# EAGLE schematic HandCream2040 (EAGLE 9.6.2)
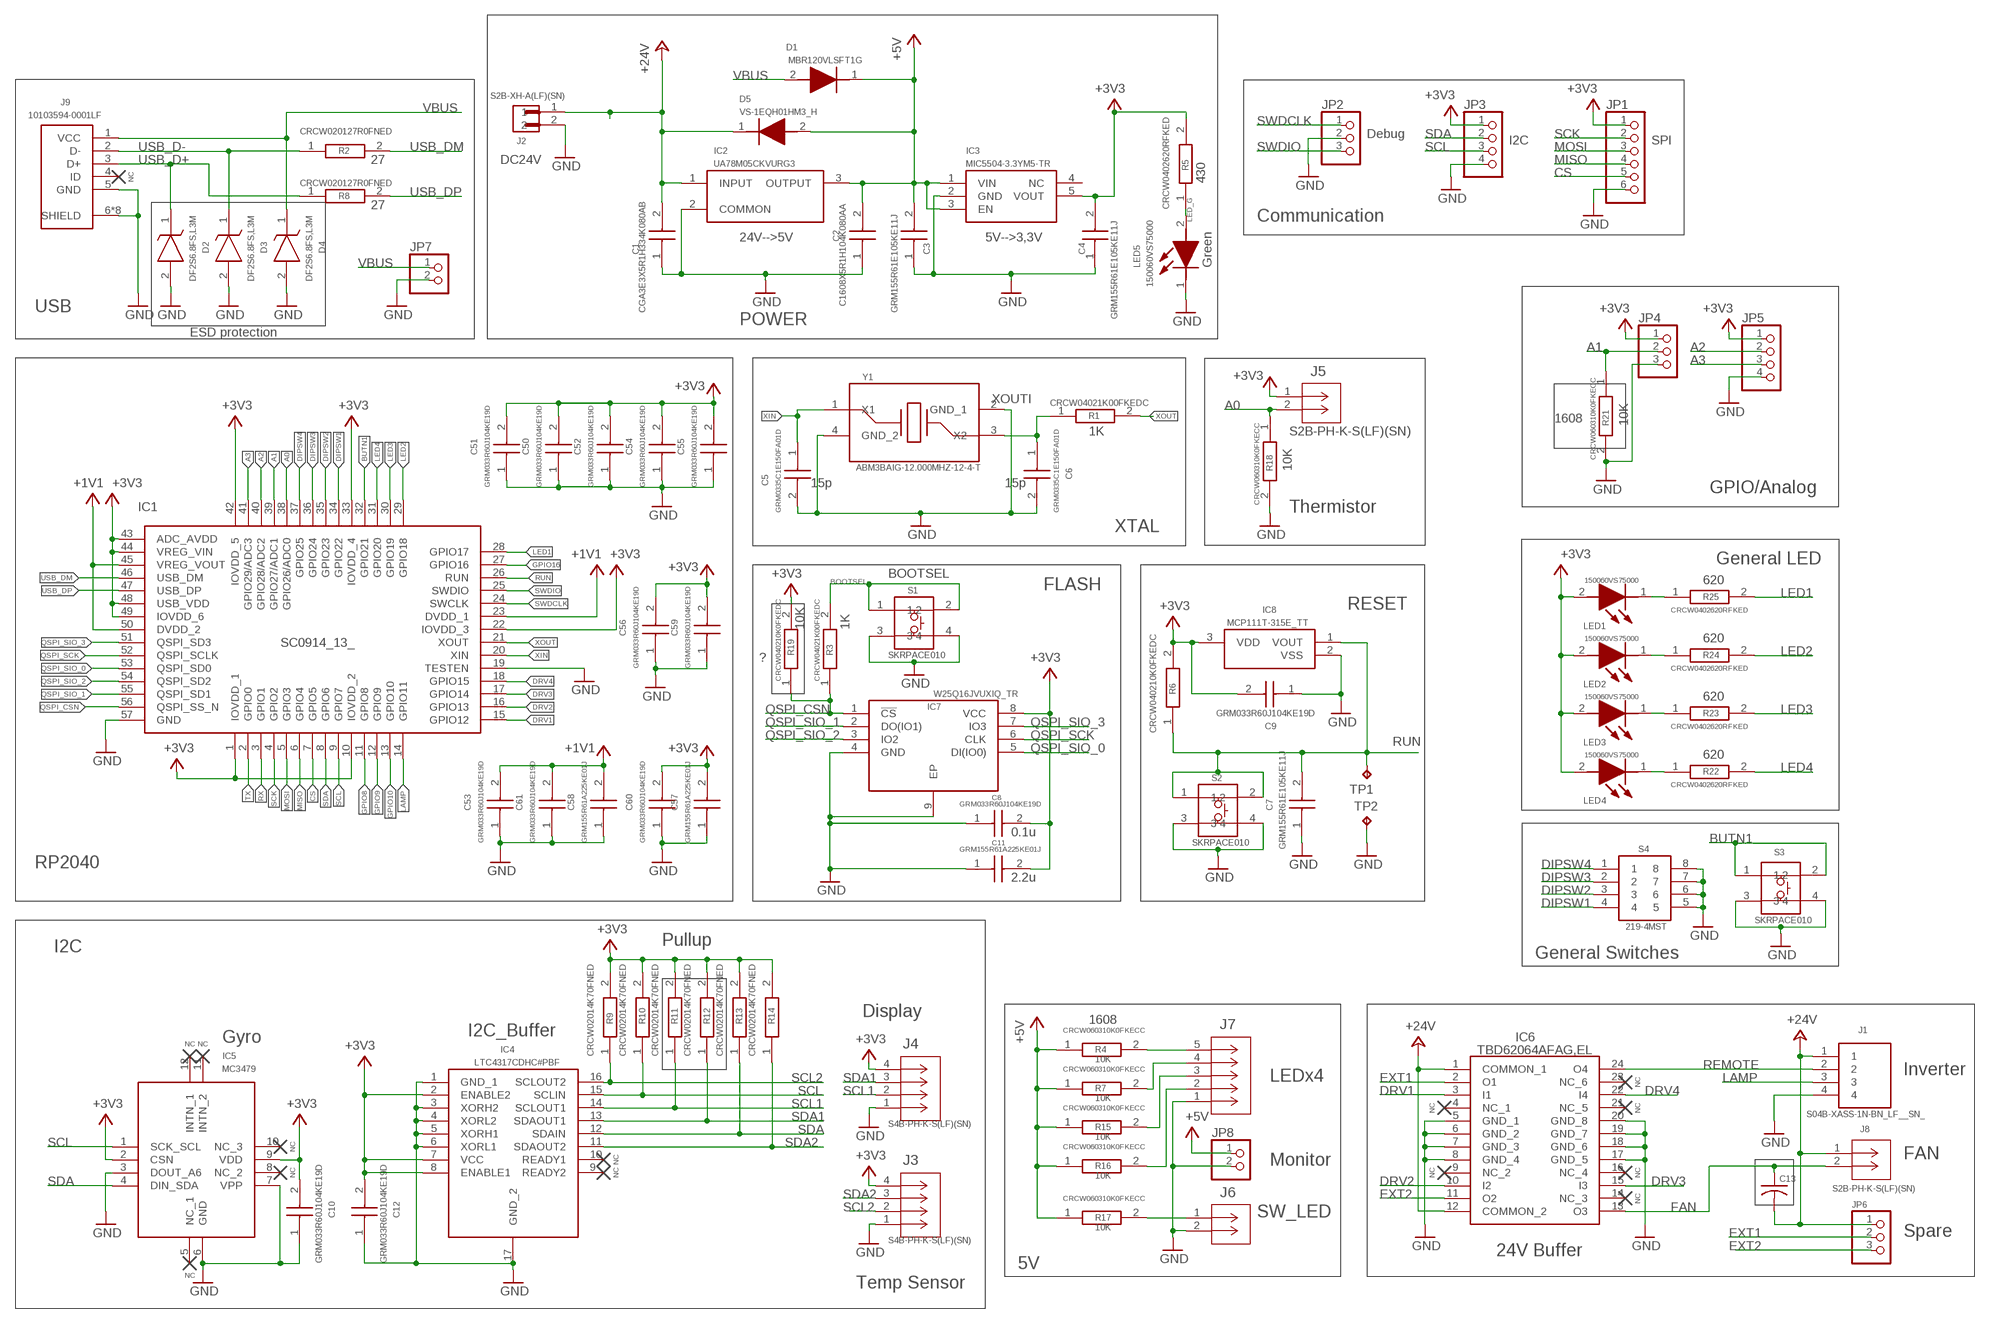
[diagram p0: schematic, sheet 1]

## Parts
C1  CGA3E3X5R1H334K080AB  [CAPC1608X90N]
C2  C1608X5R1H104K080AA  [CAPC1608X80N]
C3  GRM155R61E105KE11J  [CAPC1005X55N]
C4  GRM155R61E105KE11J  [CAPC1005X55N]
C5  GRM0335C1E150FA01D  [CAPC0603X33N]
C6  GRM0335C1E150FA01D  [CAPC0603X33N]
C7  GRM155R61E105KE11J  [CAPC1005X55N]
C8  GRM033R60J104KE19D  [CAPC0603X33N]
C9  GRM033R60J104KE19D  [CAPC0603X33N]
C10  GRM033R60J104KE19D  [CAPC0603X33N]
C11  GRM155R61A225KE01J  [CAPC1005X55N]
C12  GRM033R60J104KE19D  [CAPC0603X33N]
C13  C-US025-024X044  [C025-024X044]
C50  GRM033R60J104KE19D  [CAPC0603X33N]
C51  GRM033R60J104KE19D  [CAPC0603X33N]
C52  GRM033R60J104KE19D  [CAPC0603X33N]
C53  GRM033R60J104KE19D  [CAPC0603X33N]
C54  GRM033R60J104KE19D  [CAPC0603X33N]
C55  GRM033R60J104KE19D  [CAPC0603X33N]
C56  GRM033R60J104KE19D  [CAPC0603X33N]
C57  GRM155R61A225KE01J  [CAPC1005X55N]
C58  GRM155R61A225KE01J  [CAPC1005X55N]
C59  GRM033R60J104KE19D  [CAPC0603X33N]
C60  GRM033R60J104KE19D  [CAPC0603X33N]
C61  GRM033R60J104KE19D  [CAPC0603X33N]
D1  MBR120VLSFT1G  [SODFL3616X98N]
D2  DF2S6.8FS,L3M  [SODFL1006X45N]
D3  DF2S6.8FS,L3M  [SODFL1006X45N]
D4  DF2S6.8FS,L3M  [SODFL1006X45N]
D5  VS-1EQH01HM3_H  [VS1EQH01HM3H]
IC1  SC0914_13_  [SC091413]
IC2  UA78M05CKVURG3  [TPS7A6533QKVURQ1]
IC3  MIC5504-3.3YM5-TR  [SOT95P280X145-5N]
IC4  LTC4317CDHC#PBF  [SON50P300X500X80-17N]
IC5  MC3479  [MC3479]
IC6  TBD62064AFAG,EL  [SOP100P800X190-24N]
IC7  W25Q16JVUXIQ_TR  [SON50P300X200X60-9N]
IC8  MCP111T-315E_TT  [SOT96P237X112-3N]
J1  S04B-XASS-1N-BN_LF__SN_  [S04BXASS1NBNLFSN]
J2  S2B-XH-A(LF)(SN)  [JST_S2B-XH-A(LF)(SN)]
J3  S4B-PH-K-S(LF)(SN)  [CONN_S4B-PH-K-S_JST]
J4  S4B-PH-K-S(LF)(SN)  [CONN_S4B-PH-K-S_JST]
J5  S2B-PH-K-S(LF)(SN)  [CONN_S2B-PH-K-S_JST]
J6  S2B-PH-K-S(LF)(SN)  [CONN_S2B-PH-K-S_JST]
J7  S5B-PH-K-S_(LF)(SN)  [CONN_S5B-PH-K-S_JST]
J8  S2B-PH-K-S(LF)(SN)  [CONN_S2B-PH-K-S_JST]
J9  10103594-0001LF  [AMPHENOL_10103594-0001LF]
JP1  PINHD-1X6  [1X06]
JP2  PINHD-1X3  [1X03]
JP3  PINHD-1X4  [1X04]
JP4  PINHD-1X3  [1X03]
JP5  PINHD-1X4  [1X04]
JP6  PINHD-1X3  [1X03]
JP7  PINHD-1X2  [1X02]
JP8  PINHD-1X2  [1X02]
LED1  150060VS75000  [LEDC1608X80N]
LED2  150060VS75000  [LEDC1608X80N]
LED3  150060VS75000  [LEDC1608X80N]
LED4  150060VS75000  [LEDC1608X80N]
LED5  150060VS75000  [LEDC1608X80N]
R1  CRCW04021K00FKEDC  [RESC1005X35N]
R2  CRCW020127R0FNED  [RESC0603X28N]
R3  CRCW04021K00FKEDC  [RESC1005X35N]
R4  CRCW060310K0FKECC  [RESC1608X55N]
R5  CRCW0402620RFKED  [RESC1005X40N]
R6  CRCW040210K0FKEDC  [RESC1005X35N]
R7  CRCW060310K0FKECC  [RESC1608X55N]
R8  CRCW020127R0FNED  [RESC0603X28N]
R9  CRCW02014K70FNED  [RESC0603X28N]
R10  CRCW02014K70FNED  [RESC0603X28N]
R11  CRCW02014K70FNED  [RESC0603X28N]
R12  CRCW02014K70FNED  [RESC0603X28N]
R13  CRCW02014K70FNED  [RESC0603X28N]
R14  CRCW02014K70FNED  [RESC0603X28N]
R15  CRCW060310K0FKECC  [RESC1608X55N]
R16  CRCW060310K0FKECC  [RESC1608X55N]
R17  CRCW060310K0FKECC  [RESC1608X55N]
R18  CRCW060310K0FKECC  [RESC1608X55N]
R19  CRCW040210K0FKEDC  [RESC1005X35N]
R21  CRCW060310K0FKECC  [RESC1608X55N]
R22  CRCW0402620RFKED  [RESC1005X40N]
R23  CRCW0402620RFKED  [RESC1005X40N]
R24  CRCW0402620RFKED  [RESC1005X40N]
R25  CRCW0402620RFKED  [RESC1005X40N]
S1  SKRPACE010  [SMT(4.2X3.2)]
S2  SKRPACE010  [SMT(4.2X3.2)]
S3  SKRPACE010  [SMT(4.2X3.2)]
S4  219-4MST  [2194MST]
TP1  TPB1,27  [B1,27]
TP2  TPB1,27  [B1,27]
Y1  ABM3BAIG-12.000MHZ-12-4-T  [ABM3BAIG]

## Nets
+1V1: C53.2 C58.2 C61.2 IC1.23(DVDD_1) IC1.45(VREG_VOUT) IC1.50(DVDD_2)
+3V3: C4.2 C8.2 C9.2 C10.2 C11.2 C12.2 C50.2 C51.2 C52.2 C54.2 C55.2 C56.2 C57.2 C59.2 C60.2 IC1.1(IOVDD_1) IC1.10(IOVDD_2) IC1.22(IOVDD_3) IC1.33(IOVDD_4) IC1.42(IOVDD_5) IC1.43(ADC_AVDD) IC1.44(VREG_VIN) IC1.48(USB_VDD) IC1.49(IOVDD_6) IC3.5(VOUT) IC4.2(ENABLE2) IC4.7(VCC) IC4.8(ENABLE1) IC5.2(CSN) IC5.9(VDD) IC7.8(VCC) IC8.3(VDD) J3.4 J4.4 J5.1 JP1.1 JP3.1 JP4.1 JP5.1 LED1.2(A) LED2.2(A) LED3.2(A) LED4.2(A) R5.2 R6.2 R9.2 R10.2 R11.2 R12.2 R13.2 R14.2 R19.2
+5V: C2.2 C3.2 D1.1(K) D5.2(A) IC2.3(OUTPUT) IC3.1(VIN) IC3.3(EN) JP8.1 R4.1 R7.1 R15.1 R16.1 R17.1
+24V: C1.2 C13.2 D5.1(K) IC2.1(INPUT) IC6.1(COMMON_1) IC6.12(COMMON_2) J1.1 J2.1 J8.1 JP6.1
A0: IC1.38(GPIO26/ADC0) J5.2 R18.1
A1: IC1.39(GPIO27/ADC1) JP4.2 R21.1
A2: IC1.40(GPIO28/ADC2) JP5.2
A3: IC1.41(GPIO29/ADC3) JP5.3
BOOTSEL: R3.2 S1.1 S1.2
BUTN1: IC1.32(GPIO21) S3.1 S3.2
CS: IC1.7(GPIO5) JP1.5
DIPSW1: IC1.34(GPIO22) S4.4
DIPSW2: IC1.35(GPIO23) S4.3
DIPSW3: IC1.36(GPIO24) S4.2
DIPSW4: IC1.37(GPIO25) S4.1
DRV1: IC1.15(GPIO12) IC6.3(I1)
DRV2: IC1.16(GPIO13) IC6.10(I2)
DRV3: IC1.17(GPIO14) IC6.15(I3)
DRV4: IC1.18(GPIO15) IC6.22(I4)
EXT1: IC6.2(O1) JP6.2
EXT2: IC6.11(O2) JP6.3
FAN: C13.1 IC6.13(O3) J8.2
GND: C1.1 C2.1 C3.1 C4.1 C5.2 C6.2 C7.1 C8.1 C9.1 C10.1 C11.1 C12.1 C50.1 C51.1 C52.1 C53.1 C54.1 C55.1 C56.1 C57.1 C58.1 C59.1 C60.1 C61.1 D2.2(A) D3.2(A) D4.2(A) IC1.19(TESTEN) IC1.57(GND) IC2.2(COMMON) IC3.2(GND) IC4.1(GND_1) IC4.3(XORH2) IC4.4(XORL2) IC4.5(XORH1) IC4.6(XORL1) IC4.17(GND_2) IC5.3(DOUT_A6) IC5.6(GND) IC5.7(VPP) IC6.5(GND_1) IC6.6(GND_2) IC6.7(GND_3) IC6.8(GND_4) IC6.17(GND_5) IC6.18(GND_6) IC6.19(GND_7) IC6.20(GND_8) IC7.4(GND) IC7.9(EP) IC8.2(VSS) J1.4 J2.2 J3.1 J4.1 J6.2 J7.1 J9.5(GND) J9.6(SHIELD) J9.7(SHIELD) J9.8(SHIELD) J9.9(SHIELD) J9.10(SHIELD) J9.11(SHIELD) J9.S1(SHIELD) J9.S2(SHIELD) JP1.6 JP2.2 JP3.4 JP4.3 JP5.4 JP7.2 JP8.2 LED5.1(K) R18.2 R21.2 S1.3 S1.4 S2.3 S2.4 S3.3 S3.4 S4.5 S4.6 S4.7 S4.8 TP2.TP Y1.2(GND_1) Y1.4(GND_2)
GPIO8: IC1.11(GPIO8)
GPIO9: IC1.12(GPIO9)
GPIO10: IC1.13(GPIO10)
GPIO16: IC1.27(GPIO16)
LAMP: IC1.14(GPIO11) J1.3
LED1: IC1.28(GPIO17) R25.2
LED2: IC1.29(GPIO18) R24.2
LED3: IC1.30(GPIO19) R23.2
LED4: IC1.31(GPIO20) R22.2
LED_G: LED5.2(A) R5.1
MISO: IC1.6(GPIO4) JP1.4
MOSI: IC1.5(GPIO3) JP1.3
N$3: J7.5 R4.2
N$5: J7.4 R7.2
N$6: J7.3 R15.2
N$7: J7.2 R16.2
N$8: J6.1 R17.2
N$9: LED1.1(K) R25.1
N$11: LED2.1(K) R24.1
N$12: LED3.1(K) R23.1
N$13: LED4.1(K) R22.1
QSPI_CSN: IC1.56(QSPI_SS_N) IC7.1(!CS) R3.1 R19.1
QSPI_SCK: IC1.52(QSPI_SCLK) IC7.6(CLK)
QSPI_SIO_0: IC1.53(QSPI_SD0) IC7.5(DI(IO0))
QSPI_SIO_1: IC1.55(QSPI_SD1) IC7.2(DO(IO1))
QSPI_SIO_2: IC1.54(QSPI_SD2) IC7.3(IO2)
QSPI_SIO_3: IC1.51(QSPI_SD3) IC7.7(IO3)
REMOTE: IC6.24(O4) J1.2
RUN: C7.2 IC1.26(RUN) IC8.1(VOUT) R6.1 S2.1 S2.2 TP1.TP
RX: IC1.3(GPIO1)
SCK: IC1.4(GPIO2) JP1.2
SCL: IC1.9(GPIO7) IC4.15(SCLIN) IC5.1(SCK_SCL) JP3.3 R10.1
SCL1: IC4.14(SCLOUT1) J4.2 R11.1
SCL2: IC4.16(SCLOUT2) J3.2 R9.1
SDA: IC1.8(GPIO6) IC4.12(SDAIN) IC5.4(DIN_SDA) JP3.2 R13.1
SDA1: IC4.13(SDAOUT1) J4.3 R12.1
SDA2: IC4.11(SDAOUT2) J3.3 R14.1
SWDCLK: IC1.24(SWCLK) JP2.1
SWDIO: IC1.25(SWDIO) JP2.3
TX: IC1.2(GPIO0)
USB_D+: D2.1(K) J9.3(D+) R8.1
USB_D-: D3.1(K) J9.2(D-) R2.1
USB_DM: IC1.46(USB_DM) R2.2
USB_DP: IC1.47(USB_DP) R8.2
VBUS: D1.2(A) D4.1(K) J9.1(VCC) JP7.1
XIN: C5.1 IC1.20(XIN) Y1.1(X1)
XOUT: IC1.21(XOUT) R1.2
XOUTI: C6.1 R1.1 Y1.3(X2)
Unconnected: IC3.4(NC) IC4.9(READY2) IC4.10(READY1) IC5.5(NC_1) IC5.8(NC_2) IC5.10(NC_3) IC5.11(INTN_2) IC5.12(INTN_1) IC6.4(NC_1) IC6.9(NC_2) IC6.14(NC_3) IC6.16(NC_4) IC6.21(NC_5) IC6.23(NC_6) J9.4(ID)

## Notes on the sheet
- Debug
- I2C | SPI
- DC24V
- Communication
- 24V-->5V | 5V-->3,3V
- Green
- USB
- POWER
- ESD protection
- 1608
- GPIO/Analog
- Thermistor
- XTAL
- General LED
- BOOTSEL
- FLASH
- RESET
- ?
- RP2040
- Pullup
- I2C
- General Switches
- Display
- 1608
- I2C_Buffer
- Gyro
- Inverter
- LEDx4
- FAN
- Monitor
- SW_LED
- Spare
- 24V Buffer
- 5V
- Temp Sensor

## Library data of the parts
C1 = HandCream2040:CGA3E3X5R1H334K080AB: TDK 330nF Multilayer Ceramic Capacitor MLCC 50 V dc +/-10% X5R Dielectric 1608 Solder Max. Op. Temp. +85C Source: Datasheet; DESCRIPTION: TDK 330nF Multilayer Ceramic Capacitor MLCC 50 V dc +/-10% X5R Dielectric 1608 Solder Max. Op. Temp. +85C; HEIGHT: 0.9mm; MANUFACTURER_NAME: TDK; MANUFACTURER_PART_NUMBER: CGA3E3X5R1H334K080AB; MOUSER_PART_NUMBER: 810-CGA3E3X5R1H334KB; MOUSER_PRICE-STOCK: https://www.mouser.co.uk/ProductDetail/TDK/CGA3E3X5R1H334K080AB?qs=xLDY6iXSiQYI%252BjKItkDhww%3D%3D
C2 = HandCream2040:C1608X5R1H104K080AA: MULTILAYER CERAMIC CHIP CAPACITORS, 1608, Commercial grade, general (Up to 75V) Source: Datasheet <https://product.tdk.com/info/en/catalog/datasheets/mlcc_commercial_midvoltage_en.pdf>; DESCRIPTION: MULTILAYER CERAMIC CHIP CAPACITORS, 1608, Commercial grade, general (Up to 75V); HEIGHT: 0.8mm; MANUFACTURER_NAME: TDK; MANUFACTURER_PART_NUMBER: C1608X5R1H104K080AA; MOUSER_PART_NUMBER: 810-C1608X5R1H104K; MOUSER_PRICE-STOCK: https://www.mouser.co.uk/ProductDetail/TDK/C1608X5R1H104K080AA?qs=NRhsANhppD%2Fot2mSfg3j9A%3D%3D
C3 C4 C7 = HandCream2040:GRM155R61E105KE11J: Multilayer Ceramic Capacitors MLCC - SMD/SMT Source: Datasheet <http://www.murata.com/~/media/webrenewal/support/library/catalog/products/capacitor/mlcc/c02e.pdf>; DESCRIPTION: Multilayer Ceramic Capacitors MLCC - SMD/SMT; HEIGHT: 0.55mm; MANUFACTURER_NAME: Murata Electronics; MANUFACTURER_PART_NUMBER: GRM155R61E105KE11J; MOUSER_PART_NUMBER: 81-GRM155R61E105KE1J; MOUSER_PRICE-STOCK: https://www.mouser.co.uk/ProductDetail/Murata-Electronics/GRM155R61E105KE11J?qs=QzBtWTOodeVRe4OtPvgZ4A%3D%3D
C5 C6 = HandCream2040:GRM0335C1E150FA01D: Chip Capacitor value 150 Source: Datasheet <http://www.murata.com/~/media/webrenewal/support/library/catalog/products/capacitor/mlcc/c02e.pdf>; C: 15p; DESCRIPTION: Chip Capacitor value 150; HEIGHT: 0.33mm; MANUFACTURER_NAME: Murata Electronics; MANUFACTURER_PART_NUMBER: GRM0335C1E150FA01D; MOUSER_PART_NUMBER: 81-GRM0335C1E150FA1D; MOUSER_PRICE-STOCK: https://www.mouser.co.uk/ProductDetail/Murata-Electronics/GRM0335C1E150FA01D?qs=3ZwS9AhGA%2F5D6R%252BFa%2Fosaw%3D%3D
C8 = HandCream2040:GRM033R60J104KE19D: Ceramic SMT capacitor 100nF 6.3Vdc Murata 0201 GRM 100nF Ceramic Multilayer Capacitor, 6.3 V dc, +85C, X5R Dielectric, +/-10% Source: Datasheet <http://www.murata.com/~/media/webrenewal/support/library/catalog/products/capacitor/mlcc/c02e.pdf>; C: 0.1u; DESCRIPTION: Ceramic SMT capacitor 100nF 6.3Vdc Murata 0201 GRM 100nF Ceramic Multilayer Capacitor, 6.3 V dc, +85C, X5R Dielectric, +/-10%; HEIGHT: 0.33mm; MANUFACTURER_NAME: Murata Electronics; MANUFACTURER_PART_NUMBER: GRM033R60J104KE19D; MOUSER_PART_NUMBER: 81-GRM033R60J104KE19; MOUSER_PRICE-STOCK: https://www.mouser.co.uk/ProductDetail/Murata-Electronics/GRM033R60J104KE19D?qs=GaSm9ipITa4x559m0GMeJg%3D%3D
C9 C10 C12 C50-C56 C59-C61 = HandCream2040:GRM033R60J104KE19D: Ceramic SMT capacitor 100nF 6.3Vdc Murata 0201 GRM 100nF Ceramic Multilayer Capacitor, 6.3 V dc, +85C, X5R Dielectric, +/-10% Source: Datasheet <http://www.murata.com/~/media/webrenewal/support/library/catalog/products/capacitor/mlcc/c02e.pdf>; DESCRIPTION: Ceramic SMT capacitor 100nF 6.3Vdc Murata 0201 GRM 100nF Ceramic Multilayer Capacitor, 6.3 V dc, +85C, X5R Dielectric, +/-10%; HEIGHT: 0.33mm; MANUFACTURER_NAME: Murata Electronics; MANUFACTURER_PART_NUMBER: GRM033R60J104KE19D; MOUSER_PART_NUMBER: 81-GRM033R60J104KE19; MOUSER_PRICE-STOCK: https://www.mouser.co.uk/ProductDetail/Murata-Electronics/GRM033R60J104KE19D?qs=GaSm9ipITa4x559m0GMeJg%3D%3D
C11 = HandCream2040:GRM155R61A225KE01J: Multilayer Ceramic Capacitors MLCC - SMD/SMT Source: Datasheet <http://www.murata.com/~/media/webrenewal/support/library/catalog/products/capacitor/mlcc/c02e.pdf>; C: 2.2u; DESCRIPTION: Multilayer Ceramic Capacitors MLCC - SMD/SMT; HEIGHT: 0.55mm; MANUFACTURER_NAME: Murata Electronics; MANUFACTURER_PART_NUMBER: GRM155R61A225KE01J; MOUSER_PART_NUMBER: 81-GRM155R61A225K01J; MOUSER_PRICE-STOCK: https://www.mouser.co.uk/ProductDetail/Murata-Electronics/GRM155R61A225KE01J?qs=T3oQrply3y82IrfvEpRQug%3D%3D
C13 = HandCream2040:C-US: CAPACITOR, American symbol; SPICEPREFIX: C
C57 C58 = HandCream2040:GRM155R61A225KE01J: Multilayer Ceramic Capacitors MLCC - SMD/SMT Source: Datasheet <http://www.murata.com/~/media/webrenewal/support/library/catalog/products/capacitor/mlcc/c02e.pdf>; DESCRIPTION: Multilayer Ceramic Capacitors MLCC - SMD/SMT; HEIGHT: 0.55mm; MANUFACTURER_NAME: Murata Electronics; MANUFACTURER_PART_NUMBER: GRM155R61A225KE01J; MOUSER_PART_NUMBER: 81-GRM155R61A225K01J; MOUSER_PRICE-STOCK: https://www.mouser.co.uk/ProductDetail/Murata-Electronics/GRM155R61A225KE01J?qs=T3oQrply3y82IrfvEpRQug%3D%3D
D1 = HandCream2040:MBR120VLSFT1G: Diode Schottky 20V 1A SOD123FL ON Semi MBR120VLSFT1G, SMT Schottky Diode, 20V 1A, 2-Pin SOD-123FL Source: Datasheet <http://www.onsemi.com/pub/Collateral/MBR120VLSFT1-D.PDF>; DESCRIPTION: Diode Schottky 20V 1A SOD123FL ON Semi MBR120VLSFT1G, SMT Schottky Diode, 20V 1A, 2-Pin SOD-123FL; HEIGHT: 0.98mm; MANUFACTURER_NAME: onsemi; MANUFACTURER_PART_NUMBER: MBR120VLSFT1G; MOUSER_PART_NUMBER: 863-MBR120VLSFT1G; MOUSER_PRICE-STOCK: https://www.mouser.co.uk/ProductDetail/onsemi/MBR120VLSFT1G?qs=3JMERSakebpX%252BkItPpFCkg%3D%3D
D2-D4 = HandCream2040:DF2S6.8FS,L3M: ESD Suppressors / TVS Diodes ESD Protection Diode Source: Datasheet <http://toshiba.semicon-storage.com/info/docget.jsp?did=22219&prodName=DF2S6.8FS>; DESCRIPTION: ESD Suppressors / TVS Diodes ESD Protection Diode; HEIGHT: 0.45mm; MANUFACTURER_NAME: Toshiba; MANUFACTURER_PART_NUMBER: DF2S6.8FS,L3M; MOUSER_PART_NUMBER: 757-DF2S68FSL3M; MOUSER_PRICE-STOCK: https://www.mouser.co.uk/ProductDetail/Toshiba/DF2S6.8FSL3M?qs=eRmS5dli9yOjw7NUk6y8KQ%3D%3D
D5 = HandCream2040:VS-1EQH01HM3_H: Rectifiers 100V 1A Fred Pt MicroSMP (DO-219AD) Source: Datasheet <https://www.vishay.com/docs/96563/vs-1eqh02hm3.pdf>; DESCRIPTION: Rectifiers 100V 1A Fred Pt MicroSMP (DO-219AD); HEIGHT: 0.73mm; MANUFACTURER_NAME: Vishay; MANUFACTURER_PART_NUMBER: VS-1EQH01HM3/H; MOUSER_PART_NUMBER: 78-VS-1EQH01HM3/H; MOUSER_PRICE-STOCK: https://www.mouser.co.uk/ProductDetail/Vishay-Semiconductors/VS-1EQH01HM3-H?qs=BJlw7L4Cy78xxlCx4HTbcA%3D%3D
IC1 = HandCream2040:SC0914_13_: ARM Cortex-M0+ - Microcontroller IC 32-Bit Dual-Core 133MHz External Program Memory 56-QFN (7x7) Source: Datasheet <https://datasheets.raspberrypi.com/rp2040/rp2040-datasheet.pdf>; DESCRIPTION: ARM Cortex-M0+ - Microcontroller IC 32-Bit Dual-Core 133MHz External Program Memory 56-QFN (7x7); HEIGHT: 0.9mm; MANUFACTURER_NAME: RASPBERRY-PI; MANUFACTURER_PART_NUMBER: SC0914(13); MOUSER_PART_NUMBER: 358-SC091413; MOUSER_PRICE-STOCK: https://www.mouser.co.uk/ProductDetail/Raspberry-Pi/SC091413?qs=T%252BzbugeAwjhr%252BUbBr3TJcw%3D%3D
IC2 = HandCream2040:UA78M05CKVURG3: 500-mA, 25-V, Linear Voltage Regulators Source: Datasheet <http://www.ti.com/lit/gpn/ua78m>; DESCRIPTION: 500-mA, 25-V, Linear Voltage Regulators; HEIGHT: 2.52mm; MANUFACTURER_NAME: Texas Instruments; MANUFACTURER_PART_NUMBER: UA78M05CKVURG3; MOUSER_PART_NUMBER: 595-UA78M05CKVURG3; MOUSER_PRICE-STOCK: https://www.mouser.co.uk/ProductDetail/Texas-Instruments/UA78M05CKVURG3?qs=0O%2FZFlpUpJXWzCHdAbvEiw%3D%3D
IC3 = HandCream2040:MIC5504-3.3YM5-TR: MICROCHIP - MIC5504-3.3YM5-TR - LDO VOLT REG, 0.3A, 3.3V, SOT-23-5 Source: Datasheet <https://componentsearchengine.com/Datasheets/2/MIC5504-3.3YM5-TR.pdf>; DESCRIPTION: MICROCHIP - MIC5504-3.3YM5-TR - LDO VOLT REG, 0.3A, 3.3V, SOT-23-5; HEIGHT: 1.45mm; MANUFACTURER_NAME: Microchip; MANUFACTURER_PART_NUMBER: MIC5504-3.3YM5-TR; MOUSER_PART_NUMBER: 998-MIC5504-3.3YM5TR; MOUSER_PRICE-STOCK: https://www.mouser.co.uk/ProductDetail/Microchip-Technology/MIC5504-3.3YM5-TR?qs=U6T8BxXiZAUmVQ5Zs217qQ%3D%3D
IC4 = HandCream2040:LTC4317CDHC#PBF: LINEAR TECHNOLOGY - LTC4317CDHC#PBF - Specialized Interface, I2C, SMBus, I2C Bus & SMBus Systems Applications, Servers, Telecom, 2.25 V Source: Datasheet <https://componentsearchengine.com/Datasheets/1/LTC4317CDHC#PBF.pdf>; DESCRIPTION: LINEAR TECHNOLOGY - LTC4317CDHC#PBF - Specialized Interface, I2C, SMBus, I2C Bus & SMBus Systems Applications, Servers, Telecom, 2.25 V; HEIGHT: 0.8mm; MANUFACTURER_NAME: Analog Devices; MANUFACTURER_PART_NUMBER: LTC4317CDHC#PBF; MOUSER_PART_NUMBER: 584-LTC4317CDHC#PBF; MOUSER_PRICE-STOCK: https://www.mouser.com/Search/Refine.aspx?Keyword=584-LTC4317CDHC%23PBF
IC5 = HandCream2040:MC3479: Accelerometers Small Digital 3-axis Accelerometer Sensor Source: Datasheet <http://www.memsic.com/uploadfiles/2020/08/20200827164636363.pdf>; DESCRIPTION: Accelerometers Small Digital 3-axis Accelerometer Sensor; HEIGHT: 1mm; MANUFACTURER_NAME: MEMSIC; MANUFACTURER_PART_NUMBER: MC3479; MOUSER_PART_NUMBER: 498-MC3479; MOUSER_PRICE-STOCK: https://www.mouser.co.uk/ProductDetail/MEMSIC/MC3479?qs=OlC7AqGiEDmYmlaMvA9fTA%3D%3D
IC6 = HandCream2040:TBD62064AFAG,EL: Gate Drivers DMOS Transistor Array 50V 1500mA Source: Datasheet <http://toshiba.semicon-storage.com/info/docget.jsp?did=35936&prodName=TBD62064AFAG>; DESCRIPTION: Gate Drivers DMOS Transistor Array 50V 1500mA; HEIGHT: 1.9mm; MANUFACTURER_NAME: Toshiba; MANUFACTURER_PART_NUMBER: TBD62064AFAG,EL; MOUSER_PART_NUMBER: 757-TBD62064AFAGEHZ; MOUSER_PRICE-STOCK: https://www.mouser.co.uk/ProductDetail/Toshiba/TBD62064AFAGEL?qs=%252BEew9%252B0nqrBmaXxMy0ki7g%3D%3D
IC7 = HandCream2040:W25Q16JVUXIQ_TR: NOR Flash spiFlash, 3V, 16M-bit, 4Kb Uniform Sector, DTR Source: Datasheet <https://componentsearchengine.com/Datasheets/1/W25Q16JVUXIQ TR.pdf>; DESCRIPTION: NOR Flash spiFlash, 3V, 16M-bit, 4Kb Uniform Sector, DTR; HEIGHT: 0.6mm; MANUFACTURER_NAME: Winbond; MANUFACTURER_PART_NUMBER: W25Q16JVUXIQ TR; MOUSER_PART_NUMBER: 454-W25Q16JVUXIQTR; MOUSER_PRICE-STOCK: https://www.mouser.co.uk/ProductDetail/Winbond/W25Q16JVUXIQ-TR?qs=qSfuJ%252Bfl%2Fd7SDdIHLGOd1g%3D%3D
IC8 = HandCream2040:MCP111T-315E_TT: Microchip MCP111T-315E/TT, Voltage Supervisor 3.003 3.157 V, 3-Pin SOT-23B Source: Datasheet; DESCRIPTION: Microchip MCP111T-315E/TT, Voltage Supervisor 3.003 3.157 V, 3-Pin SOT-23B; HEIGHT: 1.12mm; MANUFACTURER_NAME: Microchip; MANUFACTURER_PART_NUMBER: MCP111T-315E/TT; MOUSER_PART_NUMBER: 579-MCP111T-315E/TT; MOUSER_PRICE-STOCK: https://www.mouser.co.uk/ProductDetail/Microchip-Technology/MCP111T-315E-TT/?qs=wEcZAI4A%2FB%2FIvXTyrLWAjQ%3D%3D
J1 = HandCream2040:S04B-XASS-1N-BN_LF__SN_: CONN HEADER R/A 4POS 2.5MM Source: Datasheet <https://www.jst-mfg.com/product/pdf/jpn/XA-WB.pdf?609c6edbcd31f>; DESCRIPTION: CONN HEADER R/A 4POS 2.5MM; HEIGHT: 7.6mm; MANUFACTURER_NAME: JST (JAPAN SOLDERLESS TERMINALS); MANUFACTURER_PART_NUMBER: S04B-XASS-1N-BN(LF)(SN)
J2 = HandCream2040:S2B-XH-A(LF)(SN): XH Series 2.5mm 2 Position Through Hole Shrouded Header Connector Check prices <https://pricing.snapeda.com/parts/S2B-XH-A%28LF%29%28SN%29/JST%20Sales/view-part?ref=eda>; AVAILABILITY: Warning; DESCRIPTION: Connector Header Through Hole, Right Angle 2 position 0.098 (2.50mm); MF: JST Sales; MP: S2B-XH-A(LF)(SN); PACKAGE: None; PRICE: None; PURCHASE-URL: https://pricing.snapeda.com/search/part/S2B-XH-A(LF)(SN)/?ref=eda
J3 J4 = HandCream2040:S4B-PH-K-S(LF)(SN); COPYRIGHT: Copyright (C) 2023 Ultra Librarian. All rights reserved.; DIGI-KEY_PART_NUMBER_1: 455-1721-ND; DIGI-KEY_PART_NUMBER_2: 455-1721-NDL; MANUFACTURER_PART_NUMBER: S4B-PH-K-S(LF)(SN); MFR_NAME: JST
J5 J6 J8 = HandCream2040:S2B-PH-K-S(LF)(SN); COPYRIGHT: Copyright (C) 2023 Ultra Librarian. All rights reserved.; DIGI-KEY_PART_NUMBER_1: 455-1719-ND; DIGI-KEY_PART_NUMBER_2: 455-1719-NDL; MANUFACTURER_PART_NUMBER: S2B-PH-K-S(LF)(SN); MFR_NAME: JST
J7 = HandCream2040:S5B-PH-K-S_(LF)(SN); COPYRIGHT: Copyright (C) 2023 Ultra Librarian. All rights reserved.; DIGI-KEY_PART_NUMBER_1: 455-1722-ND; MANUFACTURER_PART_NUMBER: S5B-PH-K-S (LF)(SN); MFR_NAME: JST
J9 = HandCream2040:10103594-0001LF: USB - micro B USB 2.0 Receptacle Connector 5 Position Surface Mount, Right Angle; Through Hole; DESCRIPTION: Micro USB 2.0, Input Output Connectors, B TYPE RECEPTACLE; DIGI-KEY_PART_NUMBER: 609-4050-2-ND; MF: Amphenol ICC; MP: 10103594-0001LF; PACKAGE: None; PURCHASE-URL: https://pricing.snapeda.com/search/part/10103594-0001LF/?ref=eda
JP1 = HandCream2040:PINHD-1X6: PIN HEADER
JP2 JP4 JP6 = HandCream2040:PINHD-1X3: PIN HEADER
JP3 JP5 = HandCream2040:PINHD-1X4: PIN HEADER
JP7 JP8 = HandCream2040:PINHD-1X2: PIN HEADER
LED1-LED5 = HandCream2040:150060VS75000: 2.4 V Green LED 1608 (0603) SMD, 2V/20mA, Wurth Elektronik WL-SMCW 150060VS75000 Source: Datasheet <https://componentsearchengine.com/Datasheets/2/150060VS75000.pdf>; DESCRIPTION: 2.4 V Green LED 1608 (0603) SMD, Wurth Elektronik WL-SMCW 150060VS75000; HEIGHT: 0.8mm; MANUFACTURER_NAME: Wurth Elektronik; MANUFACTURER_PART_NUMBER: 150060VS75000; MOUSER_PART_NUMBER: 710-150060VS75000; MOUSER_PRICE-STOCK: https://www.mouser.co.uk/ProductDetail/Wurth-Elektronik/150060VS75000?qs=LlUlMxKIyB1Q1Bi5mQ%2FKLw%3D%3D
R1 R3 = HandCream2040:CRCW04021K00FKEDC: D10/CRCW0402-C 100 1K0 1% ET7 Source: Datasheet; DESCRIPTION: D10/CRCW0402-C 100 1K0 1% ET7; HEIGHT: 0.35mm; MANUFACTURER_NAME: Vishay; MANUFACTURER_PART_NUMBER: CRCW04021K00FKEDC; MOUSER_PART_NUMBER: 71-CRCW04021K00FKEDC; MOUSER_PRICE-STOCK: https://www.mouser.co.uk/ProductDetail/Vishay-Dale/CRCW04021K00FKEDC?qs=E3Y5ESvWgWMj5mY%252BhDIyqg%3D%3D; R: 1K
R2 R8 = HandCream2040:CRCW020127R0FNED: VISHAY - CRCW020127R0FNED - RES, THICK FILM, 27R, 1%, 0.05W, 0201 Source: Datasheet <http://www.vishay.com/docs/20035/dcrcwe3.pdf>; DESCRIPTION: VISHAY - CRCW020127R0FNED - RES, THICK FILM, 27R, 1%, 0.05W, 0201; HEIGHT: 0.28mm; MANUFACTURER_NAME: Vishay; MANUFACTURER_PART_NUMBER: CRCW020127R0FNED; MOUSER_PART_NUMBER: 71-CRCW020127R0FNED; MOUSER_PRICE-STOCK: https://www.mouser.co.uk/ProductDetail/Vishay-Dale/CRCW020127R0FNED?qs=3bSaU8eFeoG6a73XMZKF3w%3D%3D; R: 27
R4 R7 R15-R18 R21 = HandCream2040:CRCW060310K0FKECC: Res Thick Film 0603 10K Ohm 1% 0.1W(1/10W) +/-100ppm/C Pad SMD T/R Source: Datasheet <https://www.arrow.com/en/products/crcw060310k0fkecc/vishay?region=nac>; DESCRIPTION: Res Thick Film 0603 10K Ohm 1% 0.1W(1/10W) +/-100ppm/C Pad SMD T/R; HEIGHT: 0.55mm; MANUFACTURER_NAME: Vishay; MANUFACTURER_PART_NUMBER: CRCW060310K0FKECC; MOUSER_PART_NUMBER: 71-CRCW060310K0FKECC; MOUSER_PRICE-STOCK: https://www.mouser.co.uk/ProductDetail/Vishay-Dale/CRCW060310K0FKECC?qs=wd5RIQLrsJjYJGKL%252BLOtbQ%3D%3D; R: 10K
R5 = HandCream2040:CRCW0402620RFKED: Vishay CRCW Series Thick Film Surface Mount Resistor 402 Case 620 +/-1% 0.063W +/-100ppm/C Source: Datasheet <http://www.mouser.com/datasheet/2/427/dcrcwe3-109170.pdf>; DESCRIPTION: Vishay CRCW Series Thick Film Surface Mount Resistor 402 Case 620 +/-1% 0.063W +/-100ppm/C; HEIGHT: 0.4mm; MANUFACTURER_NAME: Vishay; MANUFACTURER_PART_NUMBER: CRCW0402620RFKED; MOUSER_PART_NUMBER: 71-CRCW0402-620-E3; MOUSER_PRICE-STOCK: https://www.mouser.com/Search/Refine.aspx?Keyword=71-CRCW0402-620-E3; R: 430
R6 = HandCream2040:CRCW040210K0FKEDC: VISHAY - CRCW040210K0FKEDC - RES, THICK FILM, 10K, 0.063W, 0402 Source: Datasheet <https://rs.componentsearchengine.com/Datasheets/2/CRCW040210K0FKEDC.pdf>; DESCRIPTION: VISHAY - CRCW040210K0FKEDC - RES, THICK FILM, 10K, 0.063W, 0402; HEIGHT: 0.35mm; MANUFACTURER_NAME: Vishay; MANUFACTURER_PART_NUMBER: CRCW040210K0FKEDC; MOUSER_PART_NUMBER: 71-CRCW040210K0FKEDC; MOUSER_PRICE-STOCK: https://www.mouser.co.uk/ProductDetail/Vishay-Dale/CRCW040210K0FKEDC?qs=E3Y5ESvWgWPiNLcGzwCGPg%3D%3D
R9-R14 = HandCream2040:CRCW02014K70FNED: VISHAY - CRCW02014K70FNED - RES, THICK FILM, 4K7, 1%, 0.05W, 0201 Source: Datasheet <http://www.vishay.com/docs/20035/dcrcwe3.pdf>; DESCRIPTION: VISHAY - CRCW02014K70FNED - RES, THICK FILM, 4K7, 1%, 0.05W, 0201; HEIGHT: 0.28mm; MANUFACTURER_NAME: Vishay; MANUFACTURER_PART_NUMBER: CRCW02014K70FNED; MOUSER_PART_NUMBER: 71-CRCW02014K70FNED; MOUSER_PRICE-STOCK: https://www.mouser.co.uk/ProductDetail/Vishay-Dale/CRCW02014K70FNED?qs=9Aka%2FNDvCXDQ%2Fr1WGNjziQ%3D%3D
R19 = HandCream2040:CRCW040210K0FKEDC: VISHAY - CRCW040210K0FKEDC - RES, THICK FILM, 10K, 0.063W, 0402 Source: Datasheet <https://rs.componentsearchengine.com/Datasheets/2/CRCW040210K0FKEDC.pdf>; DESCRIPTION: VISHAY - CRCW040210K0FKEDC - RES, THICK FILM, 10K, 0.063W, 0402; HEIGHT: 0.35mm; MANUFACTURER_NAME: Vishay; MANUFACTURER_PART_NUMBER: CRCW040210K0FKEDC; MOUSER_PART_NUMBER: 71-CRCW040210K0FKEDC; MOUSER_PRICE-STOCK: https://www.mouser.co.uk/ProductDetail/Vishay-Dale/CRCW040210K0FKEDC?qs=E3Y5ESvWgWPiNLcGzwCGPg%3D%3D; R: 10K
R22-R25 = HandCream2040:CRCW0402620RFKED: Vishay CRCW Series Thick Film Surface Mount Resistor 402 Case 620 +/-1% 0.063W +/-100ppm/C Source: Datasheet <http://www.mouser.com/datasheet/2/427/dcrcwe3-109170.pdf>; DESCRIPTION: Vishay CRCW Series Thick Film Surface Mount Resistor 402 Case 620 +/-1% 0.063W +/-100ppm/C; HEIGHT: 0.4mm; MANUFACTURER_NAME: Vishay; MANUFACTURER_PART_NUMBER: CRCW0402620RFKED; MOUSER_PART_NUMBER: 71-CRCW0402-620-E3; MOUSER_PRICE-STOCK: https://www.mouser.com/Search/Refine.aspx?Keyword=71-CRCW0402-620-E3; R: 620
S1-S3 = HandCream2040:SKRPACE010: Tactile Switches 4.2x3.2x2.5mm 260gf Source: Datasheet <http://www.alps.com/prod/info/E/HTML/Tact/SurfaceMount/SKRP/SKRPACE010.html>; DESCRIPTION: Tactile Switches 4.2x3.2x2.5mm 260gf; HEIGHT: mm; MANUFACTURER_NAME: ALPS Electric; MANUFACTURER_PART_NUMBER: SKRPACE010; MOUSER_PART_NUMBER: 688-SKRPACE010; MOUSER_PRICE-STOCK: https://www.mouser.co.uk/ProductDetail/Alps-Alpine/SKRPACE010?qs=dHDuPHwQO79W8iY66hDbLQ%3D%3D
S4 = HandCream2040:219-4MST: DIP Switches / SIP Switches Source: Datasheet <https://componentsearchengine.com/Datasheets/1/219-4MST.pdf>; DESCRIPTION: DIP Switches / SIP Switches; HEIGHT: 4.3mm; MANUFACTURER_NAME: CTS; MANUFACTURER_PART_NUMBER: 219-4MST; MOUSER_PART_NUMBER: 774-2194MST; MOUSER_PRICE-STOCK: https://www.mouser.co.uk/ProductDetail/CTS-Electronic-Components/219-4MST?qs=qNzHFtQhdJ8xGV2Z9mul9A%3D%3D
TP1 TP2 = HandCream2040:TP: Test pad
Y1 = HandCream2040:ABM3BAIG-12.000MHZ-12-4-T: 12 MHz +/-30ppm Crystal 12pF 70 Ohms 4-SMD, No Lead Source: Datasheet <https://abracon.com/AIGcrystals/ABM3BAIG.pdf>; DESCRIPTION: 12 MHz +/-30ppm Crystal 12pF 70 Ohms 4-SMD, No Lead; HEIGHT: 0.9mm; MANUFACTURER_NAME: ABRACON; MANUFACTURER_PART_NUMBER: ABM3BAIG-12.000MHZ-12-4-T; MOUSER_PART_NUMBER: 815-ABM3BAIG1212-4T; MOUSER_PRICE-STOCK: https://www.mouser.co.uk/ProductDetail/ABRACON/ABM3BAIG-12000MHz-12-4-T?qs=0lSvoLzn4L9fUl2r3xsu2A%3D%3D

## Net classes
1 power: width 0.152 mm, drill 0.152 mm, clearance 0.152 mm
2 gnd: width 0.152 mm, drill 0.152 mm, clearance 0.152 mm
3 usbvcc: width 0.152 mm, drill 0.152 mm, clearance 0.152 mm